# Altium project Length Tuning Routing.PrjPcb
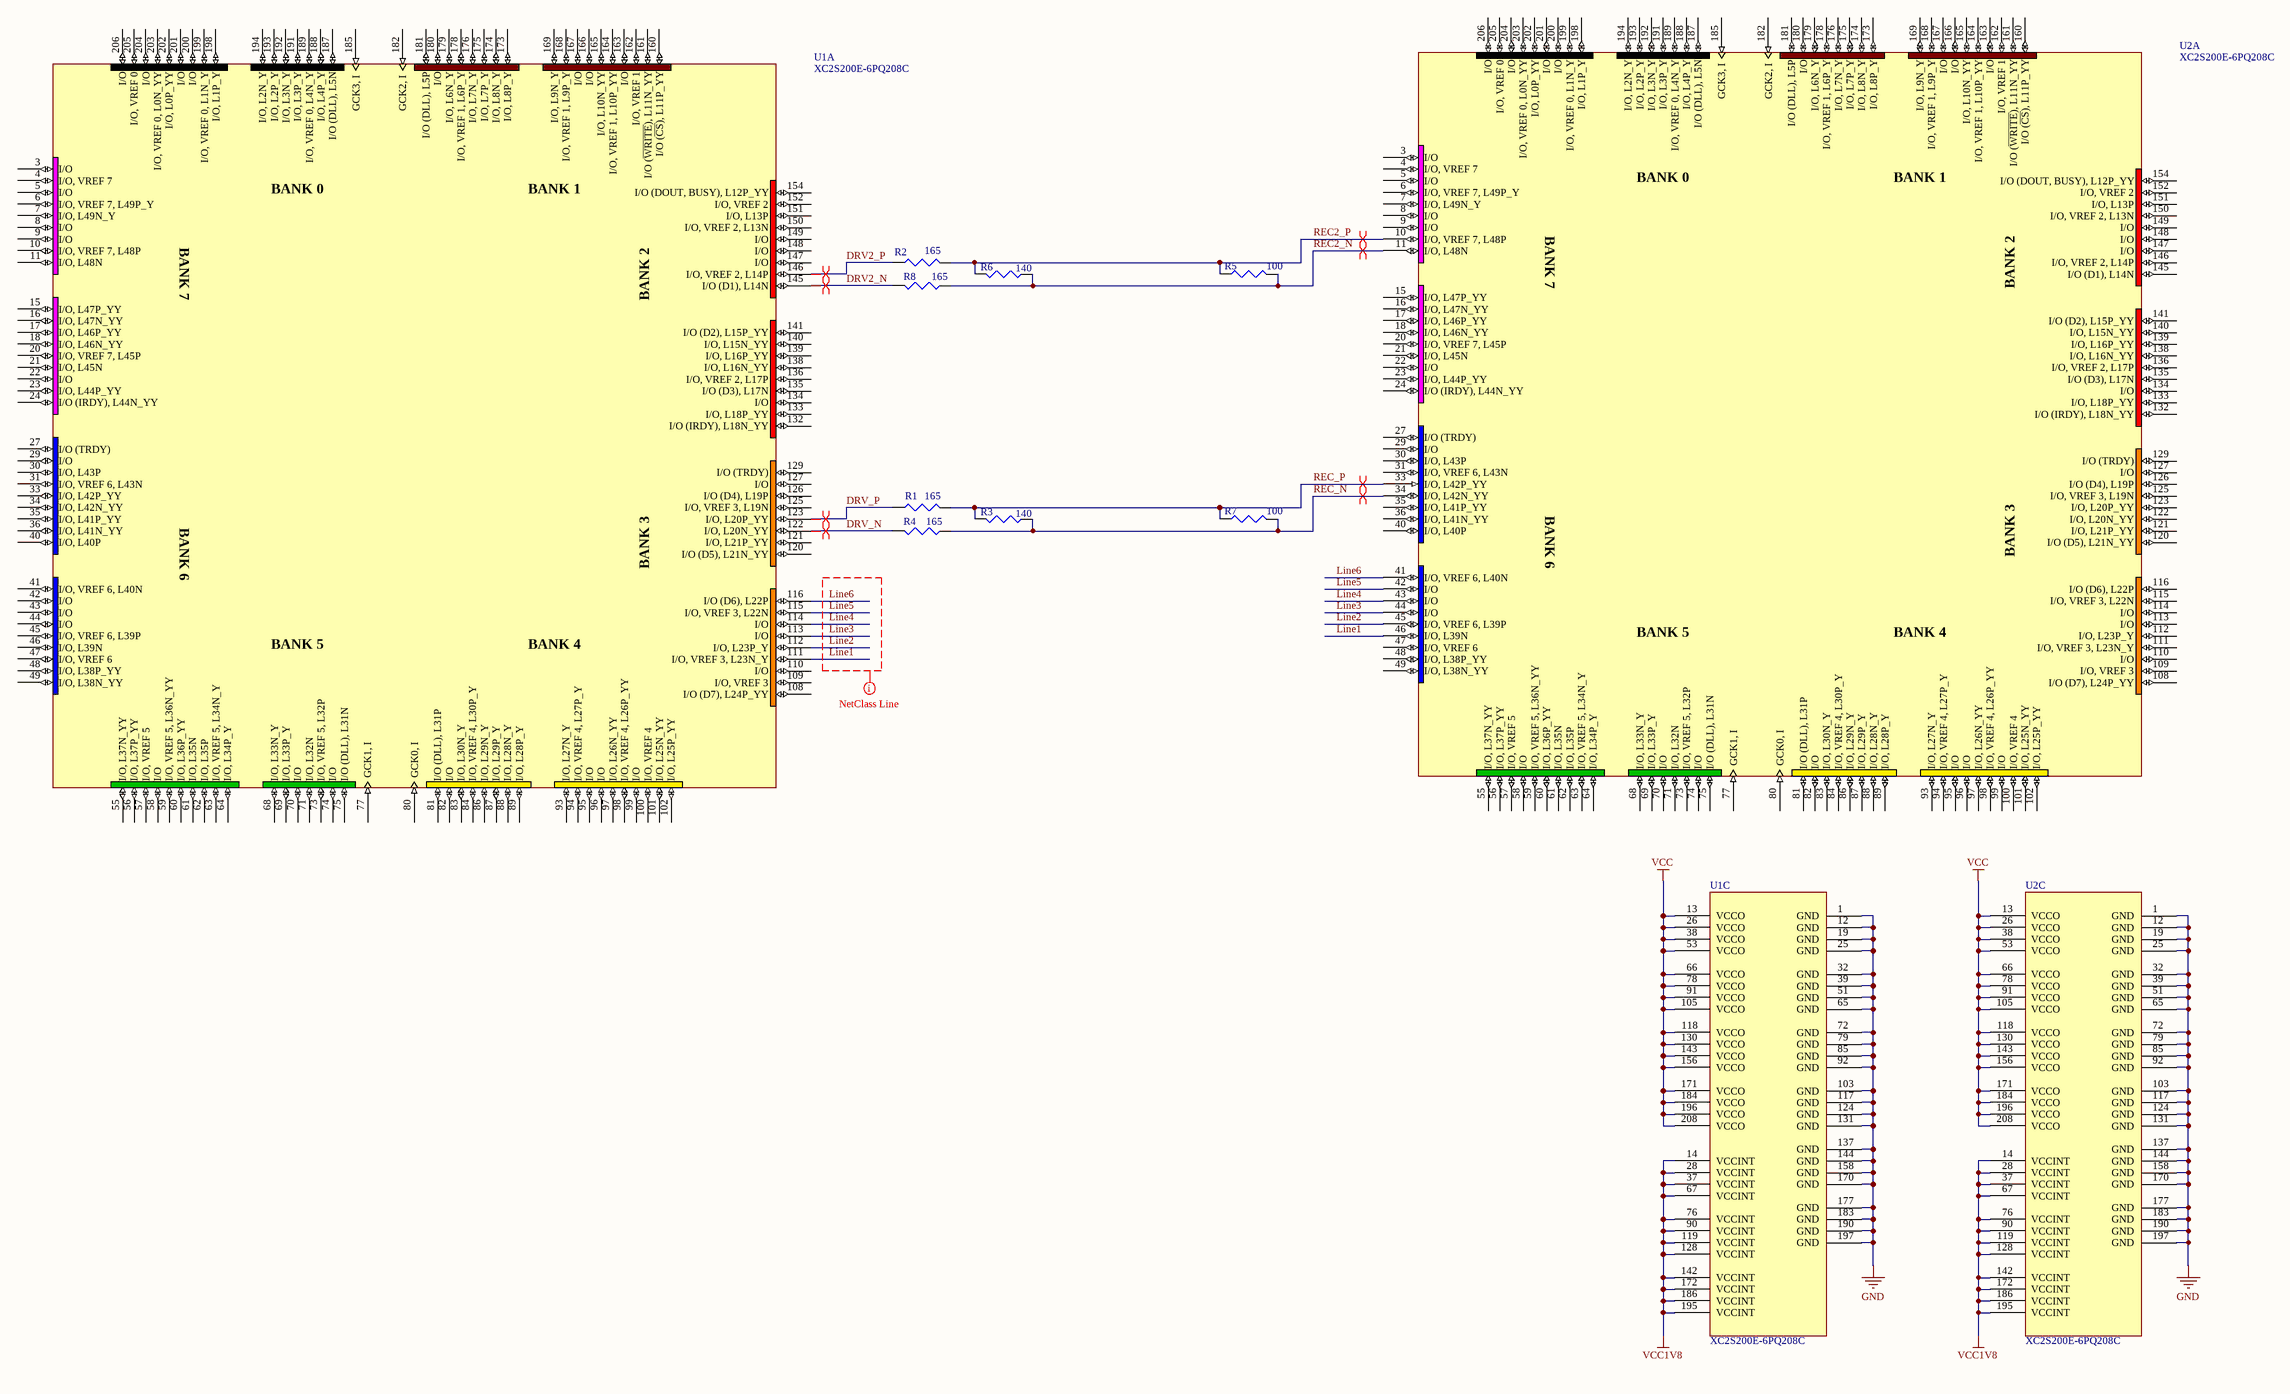
[diagram p0: Length_Tune.SchDoc]
1 sheet, 10 parts. Net scope: global (net labels, ports and power ports of the same name join across sheets).
Board file: Net_Length_Tuning.PcbDoc

## Sheet Length_Tune.SchDoc: Length Tuning Example
size 558 x 431 mm; CompanyName: Altium, Inc.; Organization: Altium, Inc.; Address1: 2175 Salk Ave.; Address2: Suite 200; Address3: Carlsbad, CA  92008; DocumentNumber: N/A; Revision: 1.0; SheetNumber: 1; SheetTotal: 1

### Parts
R1  value 165  [J1-0603]  (hidden comment: Res3)
R2  value 165  [J1-0603]  (hidden comment: Res3)
R3  value 140  [J1-0603]  (hidden comment: Res3)
R4  value 165  [J1-0603]  (hidden comment: Res3)
R5  value 100  [J1-0603]  (hidden comment: Res3)
R6  value 140  [J1-0603]  (hidden comment: Res3)
R7  value 100  [J1-0603]  (hidden comment: Res3)
R8  value 165  [J1-0603]  (hidden comment: Res3)
U1  XC2S200E-6PQ208C  [PQ208]  (parts A,C of 3)
U2  XC2S200E-6PQ208C  [PQ208]  (parts A,C of 3)

### Nets
GND: U1.1(GND) U1.12(GND) U1.19(GND) U1.25(GND) U1.32(GND) U1.39(GND) U1.51(GND) U1.65(GND) U1.72(GND) U1.79(GND) U1.85(GND) U1.92(GND) U1.103(GND) U1.117(GND) U1.124(GND) U1.131(GND) U1.137(GND) U1.144(GND) U1.158(GND) U1.170(GND) U1.177(GND) U1.183(GND) U1.190(GND) U1.197(GND) U2.1(GND) U2.12(GND) U2.19(GND) U2.25(GND) U2.32(GND) U2.39(GND) U2.51(GND) U2.65(GND) U2.72(GND) U2.79(GND) U2.85(GND) U2.92(GND) U2.103(GND) U2.117(GND) U2.124(GND) U2.131(GND) U2.137(GND) U2.144(GND) U2.158(GND) U2.170(GND) U2.177(GND) U2.183(GND) U2.190(GND) U2.197(GND)
VCC: U1.13(VCCO) U1.26(VCCO) U1.38(VCCO) U1.53(VCCO) U1.66(VCCO) U1.78(VCCO) U1.91(VCCO) U1.105(VCCO) U1.118(VCCO) U1.130(VCCO) U1.143(VCCO) U1.156(VCCO) U1.171(VCCO) U1.184(VCCO) U1.196(VCCO) U1.208(VCCO) U2.13(VCCO) U2.26(VCCO) U2.38(VCCO) U2.53(VCCO) U2.66(VCCO) U2.78(VCCO) U2.91(VCCO) U2.105(VCCO) U2.118(VCCO) U2.130(VCCO) U2.143(VCCO) U2.156(VCCO) U2.171(VCCO) U2.184(VCCO) U2.196(VCCO) U2.208(VCCO)
VCC1V8: U1.14(VCCINT) U1.28(VCCINT) U1.37(VCCINT) U1.67(VCCINT) U1.76(VCCINT) U1.90(VCCINT) U1.119(VCCINT) U1.128(VCCINT) U1.142(VCCINT) U1.172(VCCINT) U1.186(VCCINT) U1.195(VCCINT) U2.14(VCCINT) U2.28(VCCINT) U2.37(VCCINT) U2.67(VCCINT) U2.76(VCCINT) U2.90(VCCINT) U2.119(VCCINT) U2.128(VCCINT) U2.142(VCCINT) U2.172(VCCINT) U2.186(VCCINT) U2.195(VCCINT)
DRV2_N: R8.2 U1.145(I/O_(D1),_L14N)
DRV2_P: R2.1 U1.146(I/O,_VREF_2,_L14P)
DRV_N: R4.2 U1.122(I/O,_L20N_YY)
DRV_P: R1.1 U1.123(I/O,_L20P_YY)
Line1: U1.111(I/O,_VREF_3,_L23N_Y) U2.46(I/O,_L39N)
Line2: U1.112(I/O,_L23P_Y) U2.45(I/O,_VREF_6,_L39P)
Line3: U1.113(I/O) U2.44(I/O)
Line4: U1.114(I/O) U2.43(I/O)
Line5: U1.115(I/O,_VREF_3,_L22N) U2.42(I/O)
Line6: U1.116(I/O_(D6),_L22P) U2.41(I/O,_VREF_6,_L40N)
REC2_N: R5.2 R6.1 R8.1 U2.11(I/O,_L48N)
REC2_P: R2.2 R5.1 R6.2 U2.10(I/O,_VREF_7,_L48P)
REC_N: R3.1 R4.1 R7.2 U2.34(I/O,_L42N_YY)
REC_P: R1.2 R3.2 R7.1 U2.33(I/O,_L42P_YY)

Not connected (* = marked no-connect by the designer): U1 3(I/O) 4(I/O,_VREF_7) 5(I/O) 6(I/O,_VREF_7,_L49P_Y) 7(I/O,_L49N_Y) 8(I/O) 9(I/O) 10(I/O,_VREF_7,_L48P) 11(I/O,_L48N) 15(I/O,_L47P_YY) 16(I/O,_L47N_YY) 17(I/O,_L46P_YY) 18(I/O,_L46N_YY) 20(I/O,_VREF_7,_L45P) 21(I/O,_L45N) 22(I/O) 23(I/O,_L44P_YY) 24(I/O_(IRDY),_L44N_YY) 27(I/O_(TRDY)) 29(I/O) 30(I/O,_L43P) 31(I/O,_VREF_6,_L43N) 33(I/O,_L42P_YY) 34(I/O,_L42N_YY) 35(I/O,_L41P_YY) 36(I/O,_L41N_YY) 40(I/O,_L40P) 41(I/O,_VREF_6,_L40N) 42(I/O) 43(I/O) 44(I/O) 45(I/O,_VREF_6,_L39P) 46(I/O,_L39N) 47(I/O,_VREF_6) 48(I/O,_L38P_YY) 49(I/O,_L38N_YY) 55(I/O,_L37N_YY) 56(I/O,_L37P_YY) 57(I/O,_VREF_5) 58(I/O) 59(I/O,_VREF_5,_L36N_YY) 60(I/O,_L36P_YY) 61(I/O,_L35N) 62(I/O,_L35P) 63(I/O,_VREF_5,_L34N_Y) 64(I/O,_L34P_Y) 68(I/O,_L33N_Y) 69(I/O,_L33P_Y) 70(I/O) 71(I/O,_L32N) 73(I/O,_VREF_5,_L32P) 74(I/O) 75(I/O_(DLL),_L31N) 77(GCK1,_I) 80(GCK0,_I) 81(I/O_(DLL),_L31P) 82(I/O) 83(I/O,_L30N_Y) 84(I/O,_VREF_4,_L30P_Y) 86(I/O,_L29N_Y) 87(I/O,_L29P_Y) 88(I/O,_L28N_Y) 89(I/O,_L28P_Y) 93(I/O,_L27N_Y) 94(I/O,_VREF_4,_L27P_Y) 95(I/O) 96(I/O) 97(I/O,_L26N_YY) 98(I/O,_VREF_4,_L26P_YY) 99(I/O) 100(I/O,_VREF_4) 101(I/O,_L25N_YY) 102(I/O,_L25P_YY) 108(I/O_(D7),_L24P_YY) 109(I/O,_VREF_3) 110(I/O) 120(I/O_(D5),_L21N_YY) 121(I/O,_L21P_YY) 125(I/O,_VREF_3,_L19N) 126(I/O_(D4),_L19P) 127(I/O) 129(I/O_(TRDY)) 132(I/O_(IRDY),_L18N_YY) 133(I/O,_L18P_YY) 134(I/O) 135(I/O_(D3),_L17N) 136(I/O,_VREF_2,_L17P) 138(I/O,_L16N_YY) 139(I/O,_L16P_YY) 140(I/O,_L15N_YY) 141(I/O_(D2),_L15P_YY) 147(I/O) 148(I/O) 149(I/O) 150(I/O,_VREF_2,_L13N) 151(I/O,_L13P) 152(I/O,_VREF_2) 154(I/O_(DOUT,_BUSY),_L12P_YY) 160(I/O_(~{CS}),_L11P_YY) 161(I/O_(~{WRITE}),_L11N_YY) 162(I/O,_VREF_1) 163(I/O) 164(I/O,_VREF_1,_L10P_YY) 165(I/O,_L10N_YY) 166(I/O) 167(I/O) 168(I/O,_VREF_1,_L9P_Y) 169(I/O,_L9N_Y) 173(I/O,_L8P_Y) 174(I/O,_L8N_Y) 175(I/O,_L7P_Y) 176(I/O,_L7N_Y) 178(I/O,_VREF_1,_L6P_Y) 179(I/O,_L6N_Y) 180(I/O) 181(I/O_(DLL),_L5P) 182(GCK2,_I) 185(GCK3,_I) 187(I/O_(DLL),_L5N) 188(I/O,_L4P_Y) 189(I/O,_VREF_0,_L4N_Y) 191(I/O,_L3P_Y) 192(I/O,_L3N_Y) 193(I/O,_L2P_Y) 194(I/O,_L2N_Y) 198(I/O,_L1P_Y) 199(I/O,_VREF_0,_L1N_Y) 200(I/O) 201(I/O) 202(I/O,_L0P_YY) 203(I/O,_VREF_0,_L0N_YY) 204(I/O) 205(I/O,_VREF_0) 206(I/O); U2 3(I/O) 4(I/O,_VREF_7) 5(I/O) 6(I/O,_VREF_7,_L49P_Y) 7(I/O,_L49N_Y) 8(I/O) 9(I/O) 15(I/O,_L47P_YY) 16(I/O,_L47N_YY) 17(I/O,_L46P_YY) 18(I/O,_L46N_YY) 20(I/O,_VREF_7,_L45P) 21(I/O,_L45N) 22(I/O) 23(I/O,_L44P_YY) 24(I/O_(IRDY),_L44N_YY) 27(I/O_(TRDY)) 29(I/O) 30(I/O,_L43P) 31(I/O,_VREF_6,_L43N) 35(I/O,_L41P_YY) 36(I/O,_L41N_YY) 40(I/O,_L40P) 47(I/O,_VREF_6) 48(I/O,_L38P_YY) 49(I/O,_L38N_YY) 55(I/O,_L37N_YY) 56(I/O,_L37P_YY) 57(I/O,_VREF_5) 58(I/O) 59(I/O,_VREF_5,_L36N_YY) 60(I/O,_L36P_YY) 61(I/O,_L35N) 62(I/O,_L35P) 63(I/O,_VREF_5,_L34N_Y) 64(I/O,_L34P_Y) 68(I/O,_L33N_Y) 69(I/O,_L33P_Y) 70(I/O) 71(I/O,_L32N) 73(I/O,_VREF_5,_L32P) 74(I/O) 75(I/O_(DLL),_L31N) 77(GCK1,_I) 80(GCK0,_I) 81(I/O_(DLL),_L31P) 82(I/O) 83(I/O,_L30N_Y) 84(I/O,_VREF_4,_L30P_Y) 86(I/O,_L29N_Y) 87(I/O,_L29P_Y) 88(I/O,_L28N_Y) 89(I/O,_L28P_Y) 93(I/O,_L27N_Y) 94(I/O,_VREF_4,_L27P_Y) 95(I/O) 96(I/O) 97(I/O,_L26N_YY) 98(I/O,_VREF_4,_L26P_YY) 99(I/O) 100(I/O,_VREF_4) 101(I/O,_L25N_YY) 102(I/O,_L25P_YY) 108(I/O_(D7),_L24P_YY) 109(I/O,_VREF_3) 110(I/O) 111(I/O,_VREF_3,_L23N_Y) 112(I/O,_L23P_Y) 113(I/O) 114(I/O) 115(I/O,_VREF_3,_L22N) 116(I/O_(D6),_L22P) 120(I/O_(D5),_L21N_YY) 121(I/O,_L21P_YY) 122(I/O,_L20N_YY) 123(I/O,_L20P_YY) 125(I/O,_VREF_3,_L19N) 126(I/O_(D4),_L19P) 127(I/O) 129(I/O_(TRDY)) 132(I/O_(IRDY),_L18N_YY) 133(I/O,_L18P_YY) 134(I/O) 135(I/O_(D3),_L17N) 136(I/O,_VREF_2,_L17P) 138(I/O,_L16N_YY) 139(I/O,_L16P_YY) 140(I/O,_L15N_YY) 141(I/O_(D2),_L15P_YY) 145(I/O_(D1),_L14N) 146(I/O,_VREF_2,_L14P) 147(I/O) 148(I/O) 149(I/O) 150(I/O,_VREF_2,_L13N) 151(I/O,_L13P) 152(I/O,_VREF_2) 154(I/O_(DOUT,_BUSY),_L12P_YY) 160(I/O_(~{CS}),_L11P_YY) 161(I/O_(~{WRITE}),_L11N_YY) 162(I/O,_VREF_1) 163(I/O) 164(I/O,_VREF_1,_L10P_YY) 165(I/O,_L10N_YY) 166(I/O) 167(I/O) 168(I/O,_VREF_1,_L9P_Y) 169(I/O,_L9N_Y) 173(I/O,_L8P_Y) 174(I/O,_L8N_Y) 175(I/O,_L7P_Y) 176(I/O,_L7N_Y) 178(I/O,_VREF_1,_L6P_Y) 179(I/O,_L6N_Y) 180(I/O) 181(I/O_(DLL),_L5P) 182(GCK2,_I) 185(GCK3,_I) 187(I/O_(DLL),_L5N) 188(I/O,_L4P_Y) 189(I/O,_VREF_0,_L4N_Y) 191(I/O,_L3P_Y) 192(I/O,_L3N_Y) 193(I/O,_L2P_Y) 194(I/O,_L2N_Y) 198(I/O,_L1P_Y) 199(I/O,_VREF_0,_L1N_Y) 200(I/O) 201(I/O) 202(I/O,_L0P_YY) 203(I/O,_VREF_0,_L0N_YY) 204(I/O) 205(I/O,_VREF_0) 206(I/O)

### Layout directives
differential pair: DRV2_N, DRV2_P, DRV_N, DRV_P, REC2_N, REC_N
differential pair; differential pair class REC_DIFF: REC2_P, REC_P
net class LINE: Line1, Line2, Line3, Line4, Line5, Line6

### Notes on the sheet
- 10
- 9
- 8
- 7
- 6
- 5
- 4
- 3
- DWG. NO.
- 2
- 1
- REV.
- SHT.
- REVISION
- DESCRIPTION
- DATE
- APPROVED
- H
- THIS DOCUMENT AND THE DATA DISCLOSED HEREIN OR HEREWITH IS THE PROPERTY OF ALTIUM LIMITED AND MAY BE FREELY DISTRIBUTED IN WHOLE. NO RIGHTS ARE RESERVED OR EXPRESS OR IMPLIED WARANTEE GIVEN.
- G
- F
- E
- D
- C
- B
- ENG:
- DSN:
- APPROVALS
- PROJECT
- DOCUMENT REVISION:
- DESIGN ITEM:
- A
- CHK:
- BOM:
- REFERENCE DOCUMENTS
- PROJECT REVISION:
- TITLE
- FAB DWG:
- PCB DWG:
- ASSY DWG:
- SCALE:
- SIZE
- CAGE CODE
- FILE NAME
- DWG NO.
- SHEET
- OF
- REV
- (in symbol XC2S200E-6PQ208C, part A) BANK 0; BANK 1; BANK 7; BANK 2; BANK 6; BANK 3; BANK 5; BANK 4

### Library data of the parts
R1-R8 = Res3: Resistor; Published: 8-Jun-2000; LatestRevisionDate: 04-Mar-2005; LatestRevisionNote: PCB Footprint replaced.; PackageReference: J1-0603; Publisher: Altium Limited
U1 U2 = XC2S200E-6PQ208C: Spartan-IIE 1.8V FPGA, 208-Pin PQFP, Standard Performance, Commercial Grade; Package Information: Latest Revision: ver1.1, Oct-2002; Code - JEDEC: MS-029-FA-1; Published: 19-Jul-2002; Revision: 17-Sep-2003: Pin names updated to match datasheet, ver2.1.; Datasheet: Latest Revision: 09-Jul-2003; Package Reference: PQ208; Publisher: Altium Limited